# Altium schematic sheet PSU.SchDoc
size A4; SheetNumber: 2; SheetTotal: 6
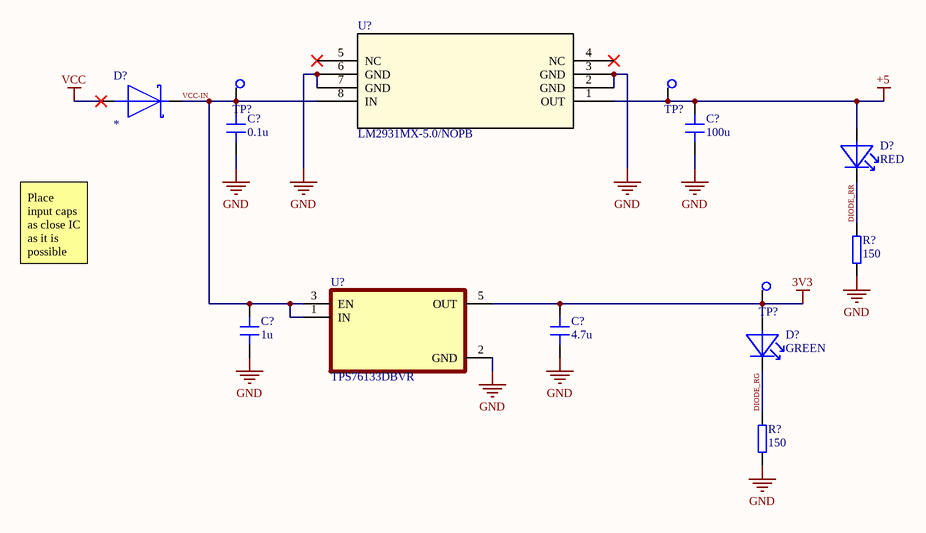
[diagram p0: PSU.SchDoc]

## Parts
(Parts that share a designator on the sheet are numbered #1, #2 ... from top to bottom, then left to right.)
C?#1  0.1u
C?#2  100u
C?#3  1u
C?#4  4.7u
D?#1  *
D?#2  RED
D?#3  GREEN
R?#1  150
R?#2  150
TP?#1  *  [TestPoint]  (value not drawn)
TP?#2  *  [TestPoint]  (value not drawn)
TP?#3  *  [TestPoint]  (value not drawn)
U?#1  LM2931MX-5.0/NOPB  [M08A_TEX]
U?#2  TPS76133DBVR  [SOT95P280X145-5N]

## Nets
3V3: C?#4.2 D?#3.1 TP?#3.1 U?#2.5(OUT)
+5: C?#2.2 D?#2.1 TP?#2.1 U?#1.1(OUT)
GND: C?#1.1 C?#2.1 C?#3.1 C?#4.1 R?#1.1 R?#2.1 U?#1.2(GND) U?#1.3(GND) U?#1.6(GND) U?#1.7(GND) U?#2.2(GND)
VCC: D?#1.1
DIODE_RG: D?#3.2 R?#2.2
DIODE_RR: D?#2.2 R?#1.2
VCC-IN: C?#1.2 C?#3.2 D?#1.2 TP?#1.1 U?#1.8(IN) U?#2.1(IN) U?#2.3(EN)

Not connected (* = marked no-connect by the designer): U?#1 4(NC)* 5(NC)*

## Notes on the sheet
- Place input caps as close IC as it is possible

## Library data of the parts
C?#1-C?#4 = Capacitor: Value: *; HelpURL: *; MPN: *; Supplier: *; SupplierPartNumber: *
D?#1 = Schotky: Value: *; HelpURL: *; MPN: *; Supplier: *; SupplierPartNumber: *
D?#2 D?#3 = LED: Value: *; HelpURL: *; MPN: *; Supplier: *; SupplierPartNumber: *
R?#1 R?#2 = Resistor: Value: *; HelpURL: *; MPN: *; Supplier: *; SupplierPartNumber: *
TP?#1-TP?#3 = TP: Value: *; HelpURL: *; MPN: *; Supplier: *; SupplierPartNumber: *
U?#1 = LM2931MX-5.0NOPB: No Description Available; Mfr_Name: Texas Instruments; Copyright: Copyright (C) 2023 Ultra Librarian. All rights reserved.; Manufacturer_Part_Number: LM2931MX-5.0/NOPB; RefDes: RefDes; Type: DEV
U?#2 = TPS76133DBVR: 100-mA, 16-V, low-dropout voltage regulator with reverse current protection 5-SOT-23 -40 to 125; MF: Texas Instruments; Price: None; MP: TPS76133DBVR; Mouser-Purchase-URL: https://snapeda.com/shop?store=Mouser&id=582733; SnapEDA_Link: https://www.snapeda.com/parts/TPS76133DBVR/Texas%20Instruments/view-part/582733/?ref=snap; Package: SOT-23-5 Texas Instruments; DigiKey-Purchase-URL: https://snapeda.com/shop?store=DigiKey&id=582733; Availability: Good; Texas_Instruments-Purchase-URL: https://snapeda.com/shop?store=Texas+Instruments&id=582733; Value: *